# Altium project bms_afe_tester-1_0.PrjPcb (part 2 of 2)

## Sheet flyback_circuit.SchDoc
size A
Used 16 times, as channels 4ch_flyback0/flyback0, 4ch_flyback0/flyback1, 4ch_flyback0/flyback2, 4ch_flyback0/flyback3, 4ch_flyback1/flyback0, 4ch_flyback1/flyback1, 4ch_flyback1/flyback2, 4ch_flyback1/flyback3, 4ch_flyback2/flyback0, 4ch_flyback2/flyback1, 4ch_flyback2/flyback2, 4ch_flyback2/flyback3, 4ch_flyback3/flyback0, 4ch_flyback3/flyback1, 4ch_flyback3/flyback2, 4ch_flyback3/flyback3. Parts and nets are listed once, with the designators drawn on the sheet.
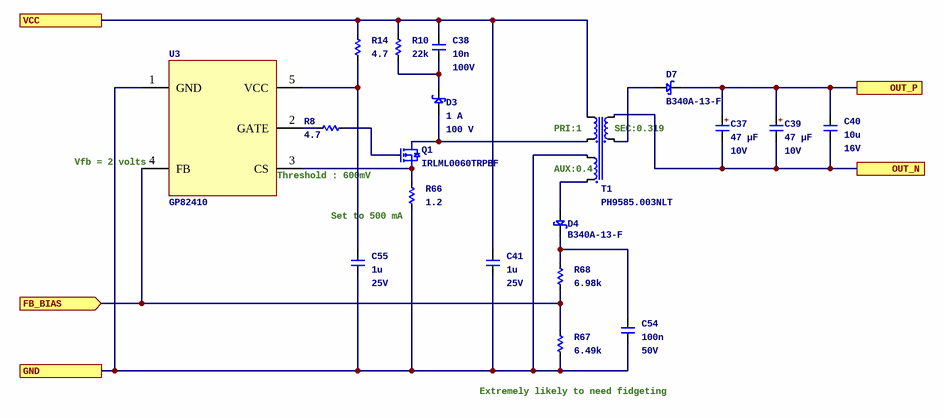
[diagram p6: flyback_circuit.SchDoc]

### Parts
C37  Capacitance: 47 µF  Voltage: 10V  [TANT_3.5MMX2.8MMX1.9MM]  (hidden comment: TAJB476M010RNJ)
C38  Capacitance: 10n  Voltage Rating: 100V  [C0603]  (hidden comment: CGA3EAC0G2A103JT000E)
C39  Capacitance: 47 µF  Voltage: 10V  [TANT_3.5MMX2.8MMX1.9MM]  (hidden comment: TAJB476M010RNJ)
C40  Capacitance: 10u  Voltage Rating: 16V  [C1206]  (hidden comment: CL31B106KOHNNNE)
C41  Capacitance: 1u  Voltage Rating: 25V  [C0603]  (hidden comment: CL10B105KA8NNNC)
C54  Capacitance: 100n  Voltage Rating: 50V  [C0402]  (hidden comment: CL05B104KB54PNC)
C55  Capacitance: 1u  Voltage Rating: 25V  [C0603]  (hidden comment: CL10B105KA8NNNC)
D3  Current: 1 A  Voltage: 100 V  [SOD123W]  (hidden comment: PMEG10010ELR-QX)
D4  B340A-13-F  [SMA]
D7  B340A-13-F  [SMA]
Q1  IRLML0060TRPBF  [3SOT23]
R8  value 4.7  [R0603]  (hidden comment: CRCW06034R70FKEAHP)
R10  value 22k  [R1206]  (hidden comment: ESR18EZPF2202)
R14  value 4.7  [R0603]  (hidden comment: CRCW06034R70FKEAHP)
R66  value 1.2  [R1206]  (hidden comment: HP06W2F120KT5E)
R67  value 6.49k  [R0402]  (hidden comment: 0402WGF6491TCE)
R68  value 6.98k  [R0402]  (hidden comment: RC0402FR-076K98L)
T1  PH9585.003NLT  [PULSE_PH9585]
U3  GP82410  [5SOT23]

### Ports
FB_BIAS (in), GND, OUT_N, OUT_P, VCC

### Nets
FB_BIAS: R67.2 R68.1 U3.4(FB) ; port FB_BIAS
GND: C41.2 C54.2 C55.2 R66.1 R67.1 T1.3 U3.1(GND) ; port GND
OUT_N: C37.2 C39.2 C40.2 T1.6 ; port OUT_N
OUT_P: C37.1 C39.1 C40.1 D7.2 ; port OUT_P
VCC: C38.1 C41.1 R10.2 R14.1 T1.1 ; port VCC
NetC38_2: C38.2 D3.2 R10.1
NetC54_1: C54.1 D4.2 R68.2
NetC55_1: C55.1 R14.2 U3.5(VCC)
NetD3_1: D3.1 Q1.3 T1.2
NetD4_1: D4.1 T1.4
NetD7_1: D7.1 T1.5
NetQ1_1: Q1.1 R8.1
NetQ1_2: Q1.2 R66.2 U3.3(CS)
NetR8_2: R8.2 U3.2(GATE)

### Channels
4ch_flyback0/flyback0: designators end in A; ports FB_BIAS=NetR67A_2 GND=GND OUT_N=C0_N OUT_P=C0_P VCC=VBUS
4ch_flyback0/flyback1: designators end in B; ports FB_BIAS=NetR67B_2 GND=GND OUT_N=C1_N OUT_P=C1_P VCC=VBUS
4ch_flyback0/flyback2: designators end in C; ports FB_BIAS=NetR67C_2 GND=GND OUT_N=C2_N OUT_P=C2_P VCC=VBUS
4ch_flyback0/flyback3: designators end in D; ports FB_BIAS=NetR67D_2 GND=GND OUT_N=C3_N OUT_P=C3_P VCC=VBUS
4ch_flyback1/flyback0: designators end in E; ports FB_BIAS=NetR67E_2 GND=GND OUT_N=C4_N OUT_P=C4_P VCC=VBUS
4ch_flyback1/flyback1: designators end in F; ports FB_BIAS=NetR67F_2 GND=GND OUT_N=C5_N OUT_P=C5_P VCC=VBUS
4ch_flyback1/flyback2: designators end in G; ports FB_BIAS=NetR67G_2 GND=GND OUT_N=C6_N OUT_P=C6_P VCC=VBUS
4ch_flyback1/flyback3: designators end in H; ports FB_BIAS=NetR67H_2 GND=GND OUT_N=C7_N OUT_P=C7_P VCC=VBUS
4ch_flyback2/flyback0: designators end in I; ports FB_BIAS=NetR67I_2 GND=GND OUT_N=C8_N OUT_P=C8_P VCC=VBUS
4ch_flyback2/flyback1: designators end in J; ports FB_BIAS=NetR67J_2 GND=GND OUT_N=C9_N OUT_P=C9_P VCC=VBUS
4ch_flyback2/flyback2: designators end in K; ports FB_BIAS=NetR67K_2 GND=GND OUT_N=C10_N OUT_P=C10_P VCC=VBUS
4ch_flyback2/flyback3: designators end in L; ports FB_BIAS=NetR67L_2 GND=GND OUT_N=C11_N OUT_P=C11_P VCC=VBUS
4ch_flyback3/flyback0: designators end in M; ports FB_BIAS=NetR67M_2 GND=GND OUT_N=C12_N OUT_P=C12_P VCC=VBUS
4ch_flyback3/flyback1: designators end in N; ports FB_BIAS=NetR67N_2 GND=GND OUT_N=C13_N OUT_P=C13_P VCC=VBUS
4ch_flyback3/flyback2: designators end in O; ports FB_BIAS=NetR67O_2 GND=GND OUT_N=C14_N OUT_P=C14_P VCC=VBUS
4ch_flyback3/flyback3: designators end in P; ports FB_BIAS=NetR67P_2 GND=GND OUT_N=C15_N OUT_P=C15_P VCC=VBUS

### Notes on the sheet
- (near U3) Vfb = 2 volts
- (near U3) Threshold : 600mV
- (near R66) Set to 500 mA
- Extremely likely to need fidgeting
- (in symbol CAP_TANT_47UF_10V_TAJB476M010RNJ) +
- (in symbol TRANS_PULSE_PH9585.003NLT) PRI:1; SEC:0.319; AUX:0.4

### Library data of the parts
C37 C39 = CAP_TANT_47UF_10V_TAJB476M010RNJ: 47 µF Molded Tantalum Capacitors 10 V 1411 (3528 Metric), 1210 1Ohm; Manufacturer: KYOCERA AVX; Manufacturer Part Number: TAJB476M010RNJ; ComponentLink1URL: https://industrial.panasonic.com/cdbs/www-data/pdf/RDD0000/ABA0000C1234.pdf; ComponentLink1Description: Datasheet; Supplier 1: Digikey; Supplier Part Number 1: 478-3891-1-ND; Supplier 2: LCSC; Supplier Part Number 2: C8021
C38 = CGA3EAC0G2A103JT000E: Manufacturer: TDK; Dielectric: C0G; Manufacturer Part Number: CGA3EAC0G2A103JT000E; ComponentLink1URL: https://wmsc.lcsc.com/wmsc/upload/file/pdf/v2/lcsc/2304140030_TDK-CGA3EAC0G2A103JT000E_C342796.pdf; ComponentLink1Description: Datasheet; Package: 0603; Supplier 2: LCSC; Supplier Part Number 2: C342796
C40 = CL31B106KOHNNNE: Manufacturer: Samsung Electro-Mechanics; Dielectric: X7R; Manufacturer Part Number: CL31B106KOHNNNE; ComponentLink1URL: https://wmsc.lcsc.com/wmsc/upload/file/pdf/v2/lcsc/2304140030_Samsung-Electro-Mechanics-CL31B106KOHNNNE_C47971.pdf; ComponentLink1Description: Datasheet; Package: 1206; Supplier 2: LCSC; Supplier Part Number 2: C47971
C41 C55 = CL10B105KA8NNNC: Manufacturer: Samsung Electro-Mechanics; Dielectric: X7R; Manufacturer Part Number: CL10B105KA8NNNC; ComponentLink1URL: https://wmsc.lcsc.com/wmsc/upload/file/pdf/v2/lcsc/2304140030_Samsung-Electro-Mechanics-CL10B105KA8NNNC_C29936.pdf; ComponentLink1Description: Datasheet; Package: 0603; Supplier 2: LCSC; Supplier Part Number 2: C29936
C54 = CL05B104KB54PNC: Manufacturer: Samsung Electro-Mechanics; Dielectric: X7R; ComponentLink1URL: https://wmsc.lcsc.com/wmsc/upload/file/pdf/v2/lcsc/2304140030_Samsung-Electro-Mechanics-CL05B104KB54PNC_C307331.pdf; ComponentLink1Description: Datasheet; Manufacturer Part Number: CL05B104KB54PNC; Package: 0402; Supplier 2: LCSC; Supplier Part Number 2: C307331
D3 = SCHOTTKY_100V_PMEG10010ELR-QX: DIODE SCHOTTKY 100V 1A SOD123W; Manufacturer: Nexperia; Supplier 1: Digikey; Supplier Part Number 1: 1727-PMEG10010ELR-QXCT-ND; Manufacturer Part Number: PMEG10010ELR-QX; Supplier 2: LCSC; Supplier Part Number 2: C5361358; ComponentLink1Description: Datasheet; ComponentLink1URL: https://assets.nexperia.com/documents/data-sheet/PMEG10010ELR-Q.pdf
D4 D7 = SCHOTTKY_B340A-13-F: Rectifier Diode, Schottky, 1 Phase, 1 Element, 3A, 40V V(RRM), Silicon; Manufacturer: Diodes; Supplier 1: Digikey; Supplier Part Number 1: B340A-FDICT-ND; Manufacturer Part Number: B340A-13-F; ComponentLink1Description: Datasheet; ComponentLink1URL: https://www.diodes.com/assets/Datasheets/ds30891.pdf; Supplier 2: LCSC; Supplier Part Number 2: C85098
Q1 = NFET_60V_IRLML0060TRPBF: N-Channel 60 V 2.7A (Ta) 1.25W (Ta) Surface Mount Micro3™/SOT-23; Manufacturer: Infineon Technologies; Supplier 1: Digikey; Supplier Part Number 1: IRLML0060TRPBFCT-ND; Manufacturer Part Number: IRLML0060TRPBF; Supplier 2: LCSC; Supplier Part Number 2: C67274; ComponentLink1Description: Datasheet; ComponentLink1URL: https://www.infineon.com/assets/row/public/documents/24/49/infineon-irlml0060-ds-en.pdf
R8 R14 = CRCW06034R70FKEAHP: Manufacturer: Vishay Intertech; Tolerance: 1%; Temperature Coefficient: Â±100ppm/â„ƒ; Power Rating (mW): 333; Manufacturer Part Number: CRCW06034R70FKEAHP; ComponentLink1Description: Datasheet; ComponentLink1URL: https://wmsc.lcsc.com/wmsc/upload/file/pdf/v2/lcsc/2312110926_Vishay-Intertech-CRCW06034R70FKEAHP_C313771.pdf; Package: 0603; Supplier 2: LCSC; Supplier Part Number 2: C313771
R10 = ESR18EZPF2202: Manufacturer: ROHM Semicon; Tolerance: 1%; Temperature Coefficient: Â±100ppm/â„ƒ; Power Rating (mW): 500; Manufacturer Part Number: ESR18EZPF2202; ComponentLink1Description: Datasheet; ComponentLink1URL: https://datasheet.lcsc.com/lcsc/2304140030_ROHM-Semicon-ESR18EZPF2202_C2105413.pdf; Package: 1206; Supplier 2: LCSC; Supplier Part Number 2: C2105413
R66 = HP06W2F120KT5E: Manufacturer: UNI-ROYAL(Uniroyal Elec); Tolerance: 1%; Temperature Coefficient: Â±100ppm/â„ƒ; Power Rating (mW): 500; Manufacturer Part Number: HP06W2F120KT5E; ComponentLink1Description: Datasheet; ComponentLink1URL: https://wmsc.lcsc.com/wmsc/upload/file/pdf/v2/lcsc/2304140030_UNI-ROYAL-Uniroyal-Elec-HP06W2F120KT5E_C414958.pdf; Package: 1206; Supplier 2: LCSC; Supplier Part Number 2: C414958
R67 = 0402WGF6491TCE: Manufacturer: UNI-ROYAL(Uniroyal Elec); Tolerance: 1%; Temperature Coefficient: Â±100ppm/â„ƒ; Power Rating (mW): 62.5; Manufacturer Part Number: 0402WGF6491TCE; ComponentLink1Description: Datasheet; ComponentLink1URL: https://wmsc.lcsc.com/wmsc/upload/file/pdf/v2/lcsc/2411221126_UNI-ROYAL-Uniroyal-Elec-0402WGF6491TCE_C25916.pdf; Package: 0402; Supplier 2: LCSC; Supplier Part Number 2: C25916
R68 = RC0402FR-076K98L: Manufacturer: YAGEO; Tolerance: 1%; Temperature Coefficient: Â±100ppm/â„ƒ; Power Rating (mW): 62.5; Manufacturer Part Number: RC0402FR-076K98L; ComponentLink1Description: Datasheet; ComponentLink1URL: https://wmsc.lcsc.com/wmsc/upload/file/pdf/v2/lcsc/2304140030_YAGEO-RC0402FR-076K98L_C137944.pdf; Package: 0402; Supplier 2: LCSC; Supplier Part Number 2: C137944
T1 = TRANS_PULSE_PH9585.003NLT: Flyback Converters For SMPS Transformer 2250V Isolation 430kHz Surface Mount; Manufacturer: Pulse Electronics; Manufacturer Part Number: PH9585.003NLT; Supplier 1: Digikey; Supplier Part Number 1: 553-PH9585.003NLTCT-ND; ComponentLink1Description: Datasheet; ComponentLink1URL: https://yageogroup.com/content/datasheet/asset/file/DATASHEET_P858; Supplier 2: LCSC; Supplier Part Number 2: C17554365
U3 = FLYBACK_GP82410: 70kHz 300mV~31V SOT-23-5 AC-DC Controllers and Regulators ROHS / FLYBACK_GP82410; Manufacturer: Hanrun; Manufacturer Part Number: GP82410; ComponentLink1Description: Datasheet; ComponentLink1URL: https://lcsc.com/datasheet/lcsc_datasheet_2312081757_HaloChip-GP82410_C19626938.pdf; Supplier 1: LCSC; Supplier Part Number 1: C19626938

## Sheet dac_dac4320_4ch.SchDoc
size A
Used 4 times, as channels 4ch_flyback0/dac0, 4ch_flyback1/dac0, 4ch_flyback2/dac0, 4ch_flyback3/dac0. Parts and nets are listed once, with the designators drawn on the sheet.
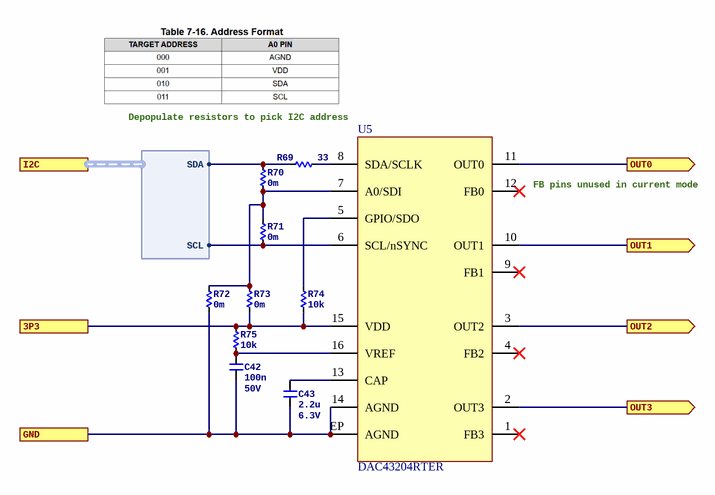
[diagram p7: dac_dac4320_4ch.SchDoc]

### Parts
C42  Capacitance: 100n  Voltage Rating: 50V  [C0402]  (hidden comment: CL05B104KB54PNC)
C43  Capacitance: 2.2u  Voltage Rating: 6.3V  [C0603]  (hidden comment: GCM188R70J225KE22D)
R69  value 33  [R0402]  (hidden comment: CRCW040233R0FKED)
R70  value 0m  [R0402]  (hidden comment: 0402WGF0000TCE)
R71  value 0m  [R0402]  (hidden comment: 0402WGF0000TCE)
R72  value 0m  [R0402]  (hidden comment: 0402WGF0000TCE)
R73  value 0m  [R0402]  (hidden comment: 0402WGF0000TCE)
R74  value 10k  [R0402]  (hidden comment: 0402WGF1002TCE)
R75  value 10k  [R0402]  (hidden comment: 0402WGF1002TCE)
U5  DAC43204RTER  [QFN50P300X300X90-16N]

### Ports
3P3, GND, I2C (harness I2C), OUT0 (out), OUT1 (out), OUT2 (out), OUT3 (out)

### Harnesses
I2C: SCL, SDA

### Nets
3P3: R73.1 R74.2 R75.2 U5.15(VDD) ; port 3P3
GND: C42.2 C43.2 R72.1 U5.14(AGND) U5.EP(AGND) ; port GND
OUT0: U5.11(OUT0) ; port OUT0
OUT1: U5.10(OUT1) ; port OUT1
OUT2: U5.3(OUT2) ; port OUT2
OUT3: U5.2(OUT3) ; port OUT3
NetC42_1: C42.1 R75.1 U5.16(VREF)
NetC43_1: C43.1 U5.13(CAP)
NetR69_1: R69.1 U5.8(SDA/SCLK)
NetR69_2: R69.2 R70.2 ; port I2C.SDA
NetR70_1: R70.1 R71.2 R72.2 R73.2 U5.7(A0/SDI)
NetR71_1: R71.1 U5.6(SCL/nSYNC) ; port I2C.SCL
NetR74_1: R74.1 U5.5(GPIO/SDO)

Not connected (* = marked no-connect by the designer): U5 1(FB3)* 4(FB2)* 9(FB1)* 12(FB0)*

### Channels
4ch_flyback0/dac0: designators end in A; ports 3P3=3P3 GND=GND OUT0=NetR67A_2 OUT1=NetR67B_2 OUT2=NetR67C_2 OUT3=NetR67D_2
4ch_flyback1/dac0: designators end in B; ports 3P3=3P3 GND=GND OUT0=NetR67E_2 OUT1=NetR67F_2 OUT2=NetR67G_2 OUT3=NetR67H_2
4ch_flyback2/dac0: designators end in C; ports 3P3=3P3 GND=GND OUT0=NetR67I_2 OUT1=NetR67J_2 OUT2=NetR67K_2 OUT3=NetR67L_2
4ch_flyback3/dac0: designators end in D; ports 3P3=3P3 GND=GND OUT0=NetR67M_2 OUT1=NetR67N_2 OUT2=NetR67O_2 OUT3=NetR67P_2

### Notes on the sheet
- Depopulate resistors to pick I2C address
- (near U5) FB pins unused in current mode

### Library data of the parts
C42 = CL05B104KB54PNC: as C54 on sheet flyback_circuit; ComponentLink1URL: https://wmsc.lcsc.com/wmsc/upload/file/pdf/v2/lcsc/2304140030_Samsung-Electro-Mechanics-CL05B104KB54PNC_C307331.pdf; ComponentLink1Description: Datasheet; Manufacturer Part Number: CL05B104KB54PNC; Package: 0402; Supplier 2: LCSC; Supplier Part Number 2: C307331
C43 = GCM188R70J225KE22D: Manufacturer: Murata Electronics; Dielectric: X7R; ComponentLink1URL: https://wmsc.lcsc.com/wmsc/upload/file/pdf/v2/lcsc/1810311130_Murata-Electronics-GCM188R70J225KE22D_C126582.pdf; ComponentLink1Description: Datasheet; Manufacturer Part Number: GCM188R70J225KE22D; Package: 0603; Supplier 2: LCSC; Supplier Part Number 2: C126582
R69 = CRCW040233R0FKED: Manufacturer: Vishay Intertech; Tolerance: 1%; Temperature Coefficient: Â±100ppm/â„ƒ; Power Rating (mW): 63; ComponentLink1Description: Datasheet; ComponentLink1URL: https://wmsc.lcsc.com/wmsc/upload/file/pdf/v2/lcsc/2304140030_Vishay-Intertech-CRCW040233R0FKED_C242490.pdf; Manufacturer Part Number: CRCW040233R0FKED; Package: 0402; Supplier 2: LCSC; Supplier Part Number 2: C242490
R70-R73 = 0402WGF0000TCE: Manufacturer: UNI-ROYAL(Uniroyal Elec); Power Rating (mW): 62.5; ComponentLink1Description: Datasheet; ComponentLink1URL: https://wmsc.lcsc.com/wmsc/upload/file/pdf/v2/lcsc/2206010216_UNI-ROYAL-Uniroyal-Elec-0402WGF0000TCE_C17168.pdf; Manufacturer Part Number: 0402WGF0000TCE; Package: 0402; Supplier 2: LCSC; Supplier Part Number 2: C17168
R74 R75 = 0402WGF1002TCE: Manufacturer: UNI-ROYAL(Uniroyal Elec); Tolerance: 1%; Temperature Coefficient: Â±100ppm/â„ƒ; Power Rating (mW): 62.5; Manufacturer Part Number: 0402WGF1002TCE; ComponentLink1Description: Datasheet; ComponentLink1URL: https://wmsc.lcsc.com/wmsc/upload/file/pdf/v2/lcsc/2206010100_UNI-ROYAL-Uniroyal-Elec-0402WGF1002TCE_C25744.pdf; Package: 0402; Supplier 2: LCSC; Supplier Part Number 2: C25744
U5 = DAC_DAC43204RTER: IC DAC 8BIT V OR A-OUT 16WQFN; Manufacturer: Texas Instruments; Manufacturer Part Number: DAC43204RTER; Supplier 1: Digi-Key; Supplier Part Number: 296-DAC43204RTERTR-ND; ComponentLink1Description: Datasheet; ComponentLink1URL: https://www.ti.com/lit/ds/symlink/dac43204.pdf; Supplier 2: LCSC; Supplier Part Number 2: C5215475

## Sheet pmic_tps65263_buck.SchDoc
size A
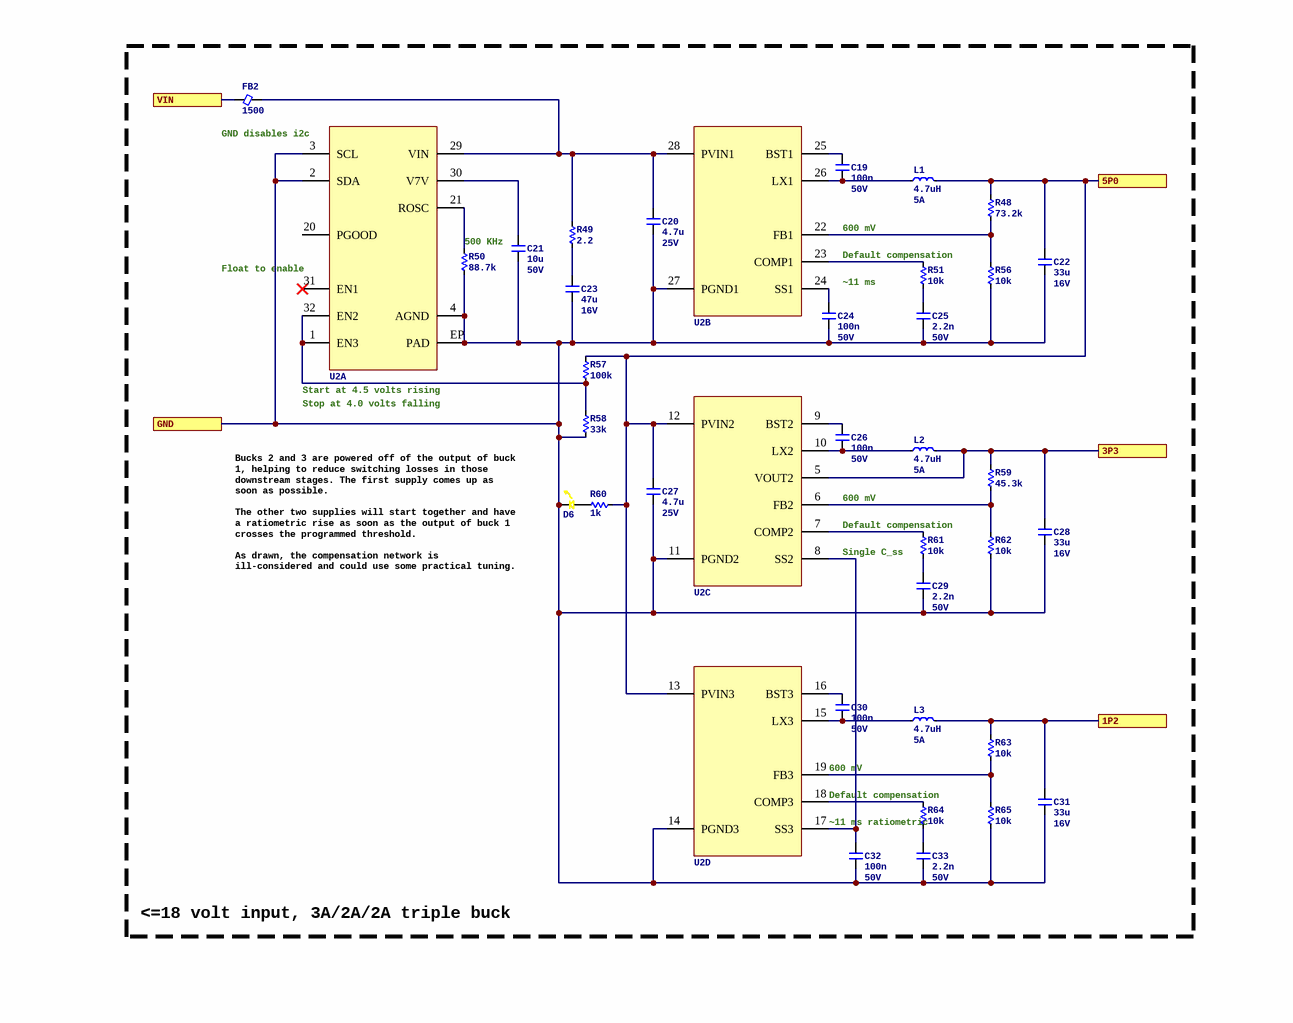
[diagram p8: pmic_tps65263_buck.SchDoc]

### Parts
C19  Capacitance: 100n  Voltage Rating: 50V  [C0402]  (hidden comment: CL05B104KB54PNC)
C20  Capacitance: 4.7u  Voltage Rating: 25V  [C0805]  (hidden comment: CL21B475KAFNNNE)
C21  Capacitance: 10u  Voltage Rating: 50V  [C1206]  (hidden comment: CL31B106KBHNNNE)
C22  Capacitance: 33u  Voltage Rating: 16V  [C1812]  (hidden comment: C4532X7R1C336MT000N)
C23  Capacitance: 47u  Voltage Rating: 16V  [C2220]  (hidden comment: CGA9N3X7R1C476MT0Y0N)
C24  Capacitance: 100n  Voltage Rating: 50V  [C0402]  (hidden comment: CL05B104KB54PNC)
C25  Capacitance: 2.2n  Voltage Rating: 50V  [C0402]  (hidden comment: GRM1555C1H222GA01D)
C26  Capacitance: 100n  Voltage Rating: 50V  [C0402]  (hidden comment: CL05B104KB54PNC)
C27  Capacitance: 4.7u  Voltage Rating: 25V  [C0805]  (hidden comment: CL21B475KAFNNNE)
C28  Capacitance: 33u  Voltage Rating: 16V  [C1812]  (hidden comment: C4532X7R1C336MT000N)
C29  Capacitance: 2.2n  Voltage Rating: 50V  [C0402]  (hidden comment: GRM1555C1H222GA01D)
C30  Capacitance: 100n  Voltage Rating: 50V  [C0402]  (hidden comment: CL05B104KB54PNC)
C31  Capacitance: 33u  Voltage Rating: 16V  [C1812]  (hidden comment: C4532X7R1C336MT000N)
C32  Capacitance: 100n  Voltage Rating: 50V  [C0402]  (hidden comment: CL05B104KB54PNC)
C33  Capacitance: 2.2n  Voltage Rating: 50V  [C0402]  (hidden comment: GRM1555C1H222GA01D)
D6  LTST-C190YKT  [LED_0603P_YELLOW]  (value not drawn)
FB2  Current Rating (mA): 1500  [FB0805]  (hidden comment: MPZ2012S102AT000)
L1  value 4.7uH  Current: 5A  [SMD-4.1x4.1x2.0]  (hidden comment: FTC404020S4R7MGCA)
L2  value 4.7uH  Current: 5A  [SMD-4.1x4.1x2.0]  (hidden comment: FTC404020S4R7MGCA)
L3  value 4.7uH  Current: 5A  [SMD-4.1x4.1x2.0]  (hidden comment: FTC404020S4R7MGCA)
R48  value 73.2k  [R0402]  (hidden comment: 0402WGF7322TCE)
R49  value 2.2  [R0805]  (hidden comment: HP05W3F220KT5E)
R50  value 88.7k  [R0402]  (hidden comment: 0402WGF8872TCE)
R51  value 10k  [R0402]  (hidden comment: 0402WGF1002TCE)
R56  value 10k  [R0402]  (hidden comment: 0402WGF1002TCE)
R57  value 100k  [R0402]  (hidden comment: 0402WGF1003TCE)
R58  value 33k  [R0402]  (hidden comment: 0402WGF3302TCE)
R59  value 45.3k  [R0402]  (hidden comment: FRC0402F4532TS)
R60  value 1k  [R0402]  (hidden comment: 0402WGF1001TCE)
R61  value 10k  [R0402]  (hidden comment: 0402WGF1002TCE)
R62  value 10k  [R0402]  (hidden comment: 0402WGF1002TCE)
R63  value 10k  [R0402]  (hidden comment: 0402WGF1002TCE)
R64  value 10k  [R0402]  (hidden comment: 0402WGF1002TCE)
R65  value 10k  [R0402]  (hidden comment: 0402WGF1002TCE)
U2  TPS65263QRHBRQ1  [TI_RHB]  (value not drawn)  (parts A,B,C,D of 4)

### Ports
1P2, 3P3, 5P0, GND, VIN

### Nets
1P2: C31.1 L3.2 R63.2 ; port 1P2
3P3: C28.1 L2.2 R59.2 U2.5(VOUT2) ; port 3P3
5P0: C22.1 C27.1 L1.2 R48.2 R57.2 R60.2 U2.12(PVIN2) U2.13(PVIN3) ; port 5P0
GND: C20.2 C21.2 C22.2 C23.2 C24.2 C25.2 C27.2 C28.2 C29.2 C31.2 C32.2 C33.2 D6.1 R50.1 R56.1 R58.1 R62.1 R65.1 U2.2(SDA) U2.3(SCL) U2.4(AGND) U2.11(PGND2) U2.14(PGND3) U2.27(PGND1) U2.EP(PAD) ; port GND
VBUS: FB2.1 ; port VIN
NetC19_1: C19.1 U2.25(BST1)
NetC19_2: C19.2 L1.1 U2.26(LX1)
NetC20_1: C20.1 FB2.2 R49.2 U2.28(PVIN1) U2.29(VIN)
NetC21_1: C21.1 U2.30(V7V)
NetC23_1: C23.1 R49.1
NetC24_1: C24.1 U2.24(SS1)
NetC25_1: C25.1 R51.1
NetC26_1: C26.1 U2.9(BST2)
NetC26_2: C26.2 L2.1 U2.10(LX2)
NetC29_1: C29.1 R61.1
NetC30_1: C30.1 U2.16(BST3)
NetC30_2: C30.2 L3.1 U2.15(LX3)
NetC32_1: C32.1 U2.8(SS2) U2.17(SS3)
NetC33_1: C33.1 R64.1
NetD6_2: D6.2 R60.1
NetR48_1: R48.1 R56.2 U2.22(FB1)
NetR50_2: R50.2 U2.21(ROSC)
NetR51_2: R51.2 U2.23(COMP1)
NetR57_1: R57.1 R58.2 U2.1(EN3) U2.32(EN2)
NetR59_1: R59.1 R62.2 U2.6(FB2)
NetR61_2: R61.2 U2.7(COMP2)
NetR63_1: R63.1 R65.2 U2.19(FB3)
NetR64_2: R64.2 U2.18(COMP3)

Not connected (* = marked no-connect by the designer): U2 20(PGOOD) 31(EN1)*

### Notes on the sheet
- GND disables i2c
- 600 mV
- (near U2) Float to enable
- (near R50) 500 KHz
- (near R51) Default compensation
- ~11 ms
- (near U2) Start at 4.5 volts rising
- Stop at 4.0 volts falling
- Single C_ss
- (near R61) Default compensation
- Bucks 2 and 3 are powered off of the output of buck 1, helping to reduce switching losses in those downstream stages. The first supply comes up as soon as possible.
  The other two supplies will start together and have a ratiometric rise as soon as the output of buck 1 crosses the programmed threshold.
  As drawn, the compensation network is ill-considered and could use some practical tuning.
- (near U2) 600 mV
- (near R64) ~11 ms ratiometric
- (near R64) Default compensation
- <=18 volt input, 3A/2A/2A triple buck

### Library data of the parts
C19 C24 C26 C30 C32 = CL05B104KB54PNC: as C54 on sheet flyback_circuit; ComponentLink1URL: https://wmsc.lcsc.com/wmsc/upload/file/pdf/v2/lcsc/2304140030_Samsung-Electro-Mechanics-CL05B104KB54PNC_C307331.pdf; ComponentLink1Description: Datasheet; Manufacturer Part Number: CL05B104KB54PNC; Package: 0402; Supplier 2: LCSC; Supplier Part Number 2: C307331
C20 C27 = CL21B475KAFNNNE: Manufacturer: Samsung Electro-Mechanics; Dielectric: X7R; ComponentLink1URL: https://wmsc.lcsc.com/wmsc/upload/file/pdf/v2/lcsc/2304140030_Samsung-Electro-Mechanics-CL21B475KAFNNNE_C98195.pdf; ComponentLink1Description: Datasheet; Manufacturer Part Number: CL21B475KAFNNNE; Package: 0805; Supplier 2: LCSC; Supplier Part Number 2: C98195
C21 = CL31B106KBHNNNE: Manufacturer: Samsung Electro-Mechanics; Dielectric: X7R; ComponentLink1URL: https://wmsc.lcsc.com/wmsc/upload/file/pdf/v2/lcsc/1810221111_Samsung-Electro-Mechanics-CL31B106KBHNNNE_C89632.pdf; ComponentLink1Description: Datasheet; Manufacturer Part Number: CL31B106KBHNNNE; Package: 1206; Supplier 2: LCSC; Supplier Part Number 2: C89632
C22 C28 C31 = C4532X7R1C336MT000N: Manufacturer: TDK; Dielectric: X7R; ComponentLink1URL: https://wmsc.lcsc.com/wmsc/upload/file/pdf/v2/lcsc/2304140030_TDK-C4532X7R1C336MT000N_C342604.pdf; ComponentLink1Description: Datasheet; Manufacturer Part Number: C4532X7R1C336MT000N; Package: 1812; Supplier 2: LCSC; Supplier Part Number 2: C342604
C23 = CGA9N3X7R1C476MT0Y0N: Manufacturer: TDK; Dielectric: X7R; ComponentLink1URL: https://wmsc.lcsc.com/wmsc/upload/file/pdf/v2/lcsc/2409301933_TDK-CGA9N3X7R1C476MT0Y0N_C342293.pdf; ComponentLink1Description: Datasheet; Manufacturer Part Number: CGA9N3X7R1C476MT0Y0N; Package: 2220; Supplier 2: LCSC; Supplier Part Number 2: C342293
C25 C29 C33 = GRM1555C1H222GA01D: Manufacturer: Murata Electronics; Dielectric: C0G; ComponentLink1URL: https://wmsc.lcsc.com/wmsc/upload/file/pdf/v2/lcsc/2206211730_Murata-Electronics-GRM1555C1H222GA01D_C2987940.pdf; ComponentLink1Description: Datasheet; Manufacturer Part Number: GRM1555C1H222GA01D; Package: 0402; Supplier 2: LCSC; Supplier Part Number 2: C2987940
D6 = LED_0603_YELLOW_LTST-C190YKT: LED YELLOW CLEAR 0603 SMD; Manufacturer: Lite-On Inc; Supplier 1: Digikey; ComponentLink1URL: https://mm.digikey.com/Volume0/opasdata/d220001/medias/docus/1176/LTST-C190YKT.pdf; ComponentLink1Description: Datasheet; Supplier Part Number 1: 160-1184-1-ND; Manufacturer Part Number: LTST-C190YKT; Supplier 2: LCSC; Supplier Part Number 2: C125097
FB2 = MPZ2012S102AT000: Manufacturer: TDK; Z @ 100 MHz: 1000; DCR (mOhms): 150; Manufacturer Part Number: MPZ2012S102AT000; Package: 0805; Supplier 2: LCSC; Supplier Part Number 2: C76817; ComponentLink1Description: Datasheet; ComponentLink1URL: https://wmsc.lcsc.com/wmsc/upload/file/pdf/v2/lcsc/2304140030_TDK-MPZ2012S102AT000_C76817.pdf
L1-L3 = IND_4.7UH_FTC404020S4R7MGCA: 5A 4.7uH 6.3A 58mΩ ±20% SMD,4.1x4.1mm Fixed Inductors RoHS; Manufacturer: cjiang; ComponentLink1URL: https://www.lcsc.com/datasheet/C39676072.pdf; ComponentLink1Description: Datasheet; Manufacturer Part Number: FTC404020S4R7MGCA; Supplier 2: LCSC; Supplier Part Number 2: C39676072
R48 = 0402WGF7322TCE: Manufacturer: UNI-ROYAL(Uniroyal Elec); Tolerance: 1%; Temperature Coefficient: Â±100ppm/â„ƒ; Power Rating (mW): 62.5; ComponentLink1Description: Datasheet; ComponentLink1URL: https://wmsc.lcsc.com/wmsc/upload/file/pdf/v2/lcsc/2206010030_UNI-ROYAL-Uniroyal-Elec-0402WGF7322TCE_C26986.pdf; Manufacturer Part Number: 0402WGF7322TCE; Package: 0402; Supplier 2: LCSC; Supplier Part Number 2: C26986
R49 = HP05W3F220KT5E: Manufacturer: UNI-ROYAL(Uniroyal Elec); Tolerance: 1%; Temperature Coefficient: Â±100ppm/â„ƒ; Power Rating (mW): 333.3; ComponentLink1Description: Datasheet; ComponentLink1URL: https://datasheet.lcsc.com/lcsc/2304140030_UNI-ROYAL-Uniroyal-Elec-HP05W3F220KT5E_C2759317.pdf; Manufacturer Part Number: HP05W3F220KT5E; Package: 0805; Supplier 2: LCSC; Supplier Part Number 2: C2759317
R50 = 0402WGF8872TCE: Manufacturer: UNI-ROYAL(Uniroyal Elec); Tolerance: 1%; Temperature Coefficient: Â±100ppm/â„ƒ; Power Rating (mW): 62.5; ComponentLink1Description: Datasheet; ComponentLink1URL: https://wmsc.lcsc.com/wmsc/upload/file/pdf/v2/lcsc/2206010045_UNI-ROYAL-Uniroyal-Elec-0402WGF8872TCE_C25922.pdf; Manufacturer Part Number: 0402WGF8872TCE; Package: 0402; Supplier 2: LCSC; Supplier Part Number 2: C25922
R51 R56 R61-R65 = 0402WGF1002TCE: as R74 on sheet dac_dac4320_4ch; ComponentLink1Description: Datasheet; ComponentLink1URL: https://wmsc.lcsc.com/wmsc/upload/file/pdf/v2/lcsc/2206010100_UNI-ROYAL-Uniroyal-Elec-0402WGF1002TCE_C25744.pdf; Manufacturer Part Number: 0402WGF1002TCE; Package: 0402; Supplier 2: LCSC; Supplier Part Number 2: C25744
R57 = 0402WGF1003TCE: Manufacturer: UNI-ROYAL(Uniroyal Elec); Tolerance: 1%; Temperature Coefficient: Â±100ppm/â„ƒ; Power Rating (mW): 62.5; ComponentLink1Description: Datasheet; ComponentLink1URL: https://wmsc.lcsc.com/wmsc/upload/file/pdf/v2/lcsc/2206010100_UNI-ROYAL-Uniroyal-Elec-0402WGF1003TCE_C25741.pdf; Manufacturer Part Number: 0402WGF1003TCE; Package: 0402; Supplier 2: LCSC; Supplier Part Number 2: C25741
R58 = 0402WGF3302TCE: Manufacturer: UNI-ROYAL(Uniroyal Elec); Tolerance: 1%; Temperature Coefficient: Â±100ppm/â„ƒ; Power Rating (mW): 62.5; ComponentLink1Description: Datasheet; ComponentLink1URL: https://wmsc.lcsc.com/wmsc/upload/file/pdf/v2/lcsc/2206010100_UNI-ROYAL-Uniroyal-Elec-0402WGF3302TCE_C25779.pdf; Manufacturer Part Number: 0402WGF3302TCE; Package: 0402; Supplier 2: LCSC; Supplier Part Number 2: C25779
R59 = FRC0402F4532TS: Manufacturer: FOJAN; Tolerance: 1%; Temperature Coefficient: Â±100ppm/â„ƒ; Power Rating (mW): 62.5; ComponentLink1Description: Datasheet; ComponentLink1URL: https://datasheet.lcsc.com/lcsc/2308241947_FOJAN-FRC0402F4532TS_C2933099.pdf; Manufacturer Part Number: FRC0402F4532TS; Package: 0402; Supplier 2: LCSC; Supplier Part Number 2: C2933099
R60 = 0402WGF1001TCE: Manufacturer: UNI-ROYAL(Uniroyal Elec); Tolerance: 1%; Temperature Coefficient: Â±100ppm/â„ƒ; Power Rating (mW): 62.5; ComponentLink1Description: Datasheet; ComponentLink1URL: https://wmsc.lcsc.com/wmsc/upload/file/pdf/v2/lcsc/2206010216_UNI-ROYAL-Uniroyal-Elec-0402WGF1001TCE_C11702.pdf; Manufacturer Part Number: 0402WGF1001TCE; Package: 0402; Supplier 2: LCSC; Supplier Part Number 2: C11702
U2 = BUCK_TPS65263QRHBRQ1: Switching Regulator, Current-mode, 3A, 2300kHz Switching Freq-Max, PQCC32; Manufacturer: Texas Instruments; ComponentLink4URL: https://www.ti.com/lit/ds/symlink/tps65263-q1.pdf; ComponentLink4Description: Datasheet; Supplier 1: Digikey; Supplier Part Number 1: 296-40886-1-ND; Supplier 2: LCSC; Supplier Part Number 2: C2073290; Manufacturer Part Number: TPS65263QRHBRQ1

## Nets that join several sheets
1P2: top (TP37.1), eth_lan8742a_phy (C50.1 U7.6), pmic_tps65263_buck (C31.1 L3.2 R63.2)
3P3: top (TP35.1), mcu_stm32f427 (21 pins), usb_husb238a (C45.1 U6.5), eth_lan8742a_phy (C49.1 FB3.1 R83.1 U7.9), 4ch_flyback0/dac0 (R73A.1 R74A.2 R75A.2 U5A.15), 4ch_flyback1/dac0 (R73B.1 R74B.2 R75B.2 U5B.15), 4ch_flyback2/dac0 (R73C.1 R74C.2 R75C.2 U5C.15), 4ch_flyback3/dac0 (R73D.1 R74D.2 R75D.2 U5D.15), pmic_tps65263_buck (C28.1 L2.2 R59.2 U2.5)
5P0: top (D2.2 TP33.1), pmic_tps65263_buck (8 pins)
GND: top (TP39.1 TP41.1 TP43.1 TP45.1), mcu_stm32f427 (27 pins), conn_usbc_power (9 pins), usb_husb238a (7 pins), eth_lan8742a_phy (15 pins), 4ch_flyback0/flyback0 (7 pins), 4ch_flyback0/flyback1 (7 pins), 4ch_flyback0/flyback2 (7 pins), 4ch_flyback0/flyback3 (7 pins), 4ch_flyback0/dac0 (5 pins), 4ch_flyback1/flyback0 (7 pins), 4ch_flyback1/flyback1 (7 pins), 4ch_flyback1/flyback2 (7 pins), 4ch_flyback1/flyback3 (7 pins), 4ch_flyback1/dac0 (5 pins), 4ch_flyback2/flyback0 (7 pins), 4ch_flyback2/flyback1 (7 pins), 4ch_flyback2/flyback2 (7 pins), 4ch_flyback2/flyback3 (7 pins), 4ch_flyback2/dac0 (5 pins), 4ch_flyback3/flyback0 (7 pins), 4ch_flyback3/flyback1 (7 pins), 4ch_flyback3/flyback2 (7 pins), 4ch_flyback3/flyback3 (7 pins), 4ch_flyback3/dac0 (5 pins), pmic_tps65263_buck (25 pins), conn_usbc_data (9 pins)
VBUS: top (TP3.1), usb_husb238a (Q3.5 Q3.6 Q3.7 Q3.8), 4ch_flyback0/flyback0 (5 pins), 4ch_flyback0/flyback1 (5 pins), 4ch_flyback0/flyback2 (5 pins), 4ch_flyback0/flyback3 (5 pins), 4ch_flyback1/flyback0 (5 pins), 4ch_flyback1/flyback1 (5 pins), 4ch_flyback1/flyback2 (5 pins), 4ch_flyback1/flyback3 (5 pins), 4ch_flyback2/flyback0 (5 pins), 4ch_flyback2/flyback1 (5 pins), 4ch_flyback2/flyback2 (5 pins), 4ch_flyback2/flyback3 (5 pins), 4ch_flyback3/flyback0 (5 pins), 4ch_flyback3/flyback1 (5 pins), 4ch_flyback3/flyback2 (5 pins), 4ch_flyback3/flyback3 (5 pins), pmic_tps65263_buck (FB2.1)
C0_N: top (H1.1 TP5.1), 4ch_flyback0/flyback0 (C37A.2 C39A.2 C40A.2 T1A.6)
C0_P: top (H2.1 TP4.1), 4ch_flyback0/flyback0 (C37A.1 C39A.1 C40A.1 D7A.2)
C1_N: top (H3.1 TP7.1), 4ch_flyback0/flyback1 (C37B.2 C39B.2 C40B.2 T1B.6)
C1_P: top (H4.1 TP6.1), 4ch_flyback0/flyback1 (C37B.1 C39B.1 C40B.1 D7B.2)
C2_N: top (H5.1 TP9.1), 4ch_flyback0/flyback2 (C37C.2 C39C.2 C40C.2 T1C.6)
C2_P: top (H6.1 TP8.1), 4ch_flyback0/flyback2 (C37C.1 C39C.1 C40C.1 D7C.2)
C3_N: top (H7.1 TP11.1), 4ch_flyback0/flyback3 (C37D.2 C39D.2 C40D.2 T1D.6)
C3_P: top (H8.1 TP10.1), 4ch_flyback0/flyback3 (C37D.1 C39D.1 C40D.1 D7D.2)
C4_N: top (H9.1 TP13.1), 4ch_flyback1/flyback0 (C37E.2 C39E.2 C40E.2 T1E.6)
C4_P: top (H10.1 TP12.1), 4ch_flyback1/flyback0 (C37E.1 C39E.1 C40E.1 D7E.2)
C5_N: top (H11.1 TP15.1), 4ch_flyback1/flyback1 (C37F.2 C39F.2 C40F.2 T1F.6)
C5_P: top (H12.1 TP14.1), 4ch_flyback1/flyback1 (C37F.1 C39F.1 C40F.1 D7F.2)
C6_N: top (H13.1 TP17.1), 4ch_flyback1/flyback2 (C37G.2 C39G.2 C40G.2 T1G.6)
C6_P: top (H14.1 TP16.1), 4ch_flyback1/flyback2 (C37G.1 C39G.1 C40G.1 D7G.2)
C7_N: top (H15.1 TP19.1), 4ch_flyback1/flyback3 (C37H.2 C39H.2 C40H.2 T1H.6)
C7_P: top (H16.1 TP18.1), 4ch_flyback1/flyback3 (C37H.1 C39H.1 C40H.1 D7H.2)
C8_N: top (H17.1 TP21.1), 4ch_flyback2/flyback0 (C37I.2 C39I.2 C40I.2 T1I.6)
C8_P: top (H18.1 TP20.1), 4ch_flyback2/flyback0 (C37I.1 C39I.1 C40I.1 D7I.2)
C9_N: top (H19.1 TP23.1), 4ch_flyback2/flyback1 (C37J.2 C39J.2 C40J.2 T1J.6)
C9_P: top (H20.1 TP22.1), 4ch_flyback2/flyback1 (C37J.1 C39J.1 C40J.1 D7J.2)
C10_N: top (H21.1 TP25.1), 4ch_flyback2/flyback2 (C37K.2 C39K.2 C40K.2 T1K.6)
C10_P: top (H22.1 TP24.1), 4ch_flyback2/flyback2 (C37K.1 C39K.1 C40K.1 D7K.2)
C11_N: top (H23.1 TP27.1), 4ch_flyback2/flyback3 (C37L.2 C39L.2 C40L.2 T1L.6)
C11_P: top (H24.1 TP26.1), 4ch_flyback2/flyback3 (C37L.1 C39L.1 C40L.1 D7L.2)
C12_N: top (H25.1 TP29.1), 4ch_flyback3/flyback0 (C37M.2 C39M.2 C40M.2 T1M.6)
C12_P: top (H26.1 TP28.1), 4ch_flyback3/flyback0 (C37M.1 C39M.1 C40M.1 D7M.2)
C13_N: top (H27.1 TP31.1), 4ch_flyback3/flyback1 (C37N.2 C39N.2 C40N.2 T1N.6)
C13_P: top (H28.1 TP30.1), 4ch_flyback3/flyback1 (C37N.1 C39N.1 C40N.1 D7N.2)
C14_N: top (H29.1 TP34.1), 4ch_flyback3/flyback2 (C37O.2 C39O.2 C40O.2 T1O.6)
C14_P: top (H30.1 TP32.1), 4ch_flyback3/flyback2 (C37O.1 C39O.1 C40O.1 D7O.2)
C15_N: top (H31.1 TP38.1), 4ch_flyback3/flyback3 (C37P.2 C39P.2 C40P.2 T1P.6)
C15_P: top (H32.1 TP36.1), 4ch_flyback3/flyback3 (C37P.1 C39P.1 C40P.1 D7P.2)
CC_PWR.CC1: conn_usbc_power (C35A.1 J11A.A5 R13A.1), usb_husb238a (U6.3)
CC_PWR.CC2: conn_usbc_power (C34A.1 J11A.B5 R12A.1), usb_husb238a (U6.4)
ETH_nRST: mcu_stm32f427 (R3.1), eth_lan8742a_phy (C51.1 R83.2 U7.15)
ETH_REFCLK: mcu_stm32f427 (U1.24), eth_lan8742a_phy (R82.2)
I2C1.SCL: mcu_stm32f427 (R36.1 TP62.1), 4ch_flyback0/dac0 (R71A.1 U5A.6), 4ch_flyback1/dac0 (R71B.1 U5B.6), 4ch_flyback2/dac0 (R71C.1 U5C.6), 4ch_flyback3/dac0 (R71D.1 U5D.6)
I2C1.SDA: mcu_stm32f427 (R35.1 R54.1 TP63.1), 4ch_flyback0/dac0 (R69A.2 R70A.2), 4ch_flyback1/dac0 (R69B.2 R70B.2), 4ch_flyback2/dac0 (R69C.2 R70C.2), 4ch_flyback3/dac0 (R69D.2 R70D.2)
NetC44_1: conn_usbc_power (C80A.1 J11A.A4 J11A.B4), usb_husb238a (7 pins)
NetC80B_1: top (D2.1), conn_usbc_data (C80B.1 J11B.A4 J11B.B4)
NetR67A_2: 4ch_flyback0/flyback0 (R67A.2 R68A.1 U3A.4), 4ch_flyback0/dac0 (U5A.11)
NetR67B_2: 4ch_flyback0/flyback1 (R67B.2 R68B.1 U3B.4), 4ch_flyback0/dac0 (U5A.10)
NetR67C_2: 4ch_flyback0/flyback2 (R67C.2 R68C.1 U3C.4), 4ch_flyback0/dac0 (U5A.3)
NetR67D_2: 4ch_flyback0/flyback3 (R67D.2 R68D.1 U3D.4), 4ch_flyback0/dac0 (U5A.2)
NetR67E_2: 4ch_flyback1/flyback0 (R67E.2 R68E.1 U3E.4), 4ch_flyback1/dac0 (U5B.11)
NetR67F_2: 4ch_flyback1/flyback1 (R67F.2 R68F.1 U3F.4), 4ch_flyback1/dac0 (U5B.10)
NetR67G_2: 4ch_flyback1/flyback2 (R67G.2 R68G.1 U3G.4), 4ch_flyback1/dac0 (U5B.3)
NetR67H_2: 4ch_flyback1/flyback3 (R67H.2 R68H.1 U3H.4), 4ch_flyback1/dac0 (U5B.2)
NetR67I_2: 4ch_flyback2/flyback0 (R67I.2 R68I.1 U3I.4), 4ch_flyback2/dac0 (U5C.11)
NetR67J_2: 4ch_flyback2/flyback1 (R67J.2 R68J.1 U3J.4), 4ch_flyback2/dac0 (U5C.10)
NetR67K_2: 4ch_flyback2/flyback2 (R67K.2 R68K.1 U3K.4), 4ch_flyback2/dac0 (U5C.3)
NetR67L_2: 4ch_flyback2/flyback3 (R67L.2 R68L.1 U3L.4), 4ch_flyback2/dac0 (U5C.2)
NetR67M_2: 4ch_flyback3/flyback0 (R67M.2 R68M.1 U3M.4), 4ch_flyback3/dac0 (U5D.11)
NetR67N_2: 4ch_flyback3/flyback1 (R67N.2 R68N.1 U3N.4), 4ch_flyback3/dac0 (U5D.10)
NetR67O_2: 4ch_flyback3/flyback2 (R67O.2 R68O.1 U3O.4), 4ch_flyback3/dac0 (U5D.3)
NetR67P_2: 4ch_flyback3/flyback3 (R67P.2 R68P.1 U3P.4), 4ch_flyback3/dac0 (U5D.2)
RMII.CRS_DV: mcu_stm32f427 (U1.32), eth_lan8742a_phy (R91.2)
RMII.RXD0: mcu_stm32f427 (U1.33), eth_lan8742a_phy (R92.2)
RMII.RXD1: mcu_stm32f427 (U1.34), eth_lan8742a_phy (R93.2)
RMII.TX_EN: mcu_stm32f427 (R38.1), eth_lan8742a_phy (U7.16)
RMII.TXD0: mcu_stm32f427 (R40.1), eth_lan8742a_phy (U7.17)
RMII.TXD1: mcu_stm32f427 (R41.1), eth_lan8742a_phy (U7.18)
SMI.MDC: mcu_stm32f427 (U1.16), eth_lan8742a_phy (U7.13)
SMI.MDIO: mcu_stm32f427 (R52.1 U1.25), eth_lan8742a_phy (R81.2)
USB._N: mcu_stm32f427 (U1.70), conn_usbc_data (D17B.2 R129B.1)
USB._P: mcu_stm32f427 (U1.71), conn_usbc_data (D17B.1 R128B.1)
USB_PWR._N: conn_usbc_power (D17A.2 R129A.1), usb_husb238a (U6.2)
USB_PWR._P: conn_usbc_power (D17A.1 R128A.1), usb_husb238a (U6.1)

## Assembly variants
0: not fitted C34A C35A R12B R13B R?A R?A R?A R?B R?B R?B R?C R?C R?C R?D R?D R?D